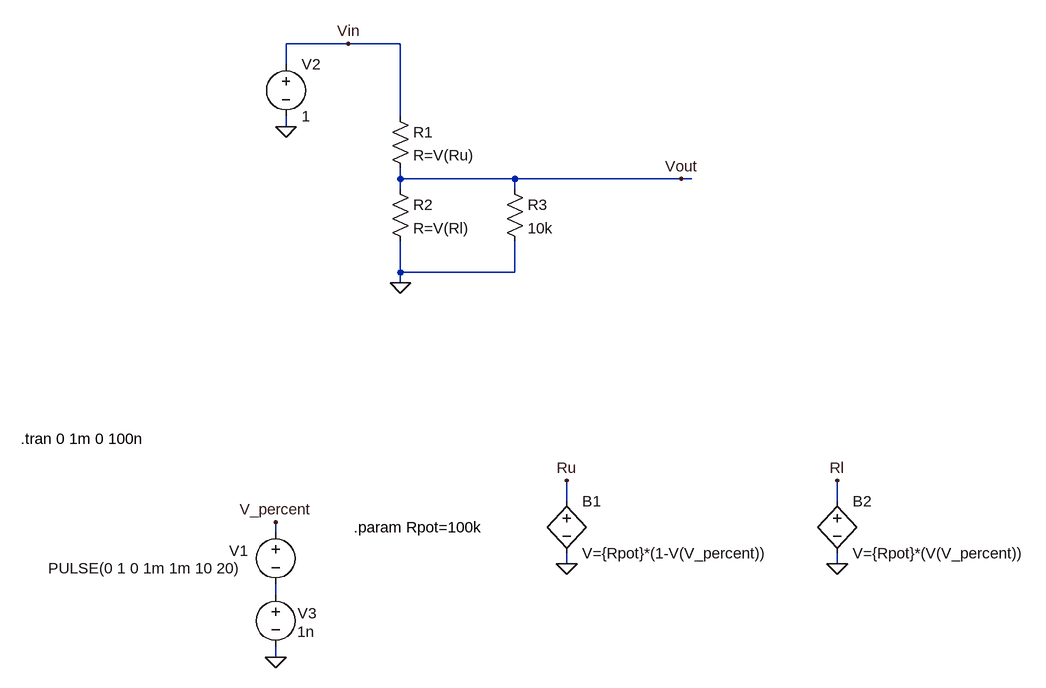
[diagram p0: schematic gammaCorrection.asc]
gammaCorrection.asc, the LTspice schematic file:
Version 4
SHEET 1 1748 680
WIRE -176 -592 -272 -592
WIRE -96 -592 -176 -592
WIRE -272 -560 -272 -592
WIRE -96 -480 -96 -592
WIRE -272 -464 -272 -480
WIRE -96 -384 -96 -400
WIRE 80 -384 -96 -384
WIRE 336 -384 80 -384
WIRE 352 -384 336 -384
WIRE -96 -368 -96 -384
WIRE 80 -368 80 -384
WIRE -96 -240 -96 -288
WIRE 80 -240 80 -288
WIRE 80 -240 -96 -240
WIRE -96 -224 -96 -240
WIRE 160 112 160 80
WIRE 576 112 576 80
WIRE -288 160 -288 144
WIRE 160 208 160 192
WIRE 576 208 576 192
WIRE -288 256 -288 240
WIRE -288 352 -288 336
FLAG -288 352 0
FLAG -288 144 V_percent
FLAG -272 -464 0
FLAG 160 208 0
FLAG 160 80 Ru
FLAG 576 208 0
FLAG 576 80 Rl
FLAG 336 -384 Vout
FLAG -176 -592 Vin
FLAG -96 -224 0
SYMBOL voltage -288 144 R0
WINDOW 0 -71 44 Left 2
WINDOW 3 -350 71 Left 2
WINDOW 123 0 0 Left 0
WINDOW 39 0 0 Left 0
SYMATTR InstName V1
SYMATTR Value PULSE(0 1 0 1m 1m 10 20)
SYMBOL res -112 -496 R0
SYMATTR InstName R1
SYMATTR Value R=V(Ru)
SYMBOL res -112 -384 R0
SYMATTR InstName R2
SYMATTR Value R=V(Rl)
SYMBOL bv 160 96 R0
SYMATTR InstName B1
SYMATTR Value V={Rpot}*(1-V(V_percent))
SYMBOL bv 576 96 R0
SYMATTR InstName B2
SYMATTR Value V={Rpot}*(V(V_percent))
SYMBOL res 64 -384 R0
SYMATTR InstName R3
SYMATTR Value 10k
SYMBOL voltage -272 -576 R0
WINDOW 123 0 0 Left 0
WINDOW 39 0 0 Left 0
SYMATTR InstName V2
SYMATTR Value 1
SYMBOL voltage -288 240 R0
WINDOW 0 34 44 Left 2
WINDOW 3 33 73 Left 2
WINDOW 123 0 0 Left 0
WINDOW 39 0 0 Left 0
SYMATTR InstName V3
SYMATTR Value 1n
TEXT -168 152 Left 2 !.param Rpot=100k
TEXT -680 16 Left 2 !.tran 0 1m 0 100n

The netlist it stands for:
* gammaCorrection.asc
V1 V_percent N001 PULSE(0 1 0 1m 1m 10 20)
R1 Vin Vout R=V(Ru)
R2 Vout 0 R=V(Rl)
B1 Ru 0 V={Rpot}*(1-V(V_percent))
B2 Rl 0 V={Rpot}*(V(V_percent))
R3 Vout 0 10k
V2 Vin 0 1
V3 N001 0 1n
.param Rpot=100k
.tran 0 1m 0 100n
.backanno
.end